# Altium schematic sheet Power.Schdoc
size B; Organization: VITRONIC Dr.-Ing. Stein Bildverarbeitungssysteme GmbH; Address1: Hasengartenstrasse 14; Address2: D-65189 Wiesbaden; Address3: Phone: 49/611/7152-0; Address4: Fax:     49/611/7152-133; SheetNumber: 3; SheetTotal: 3
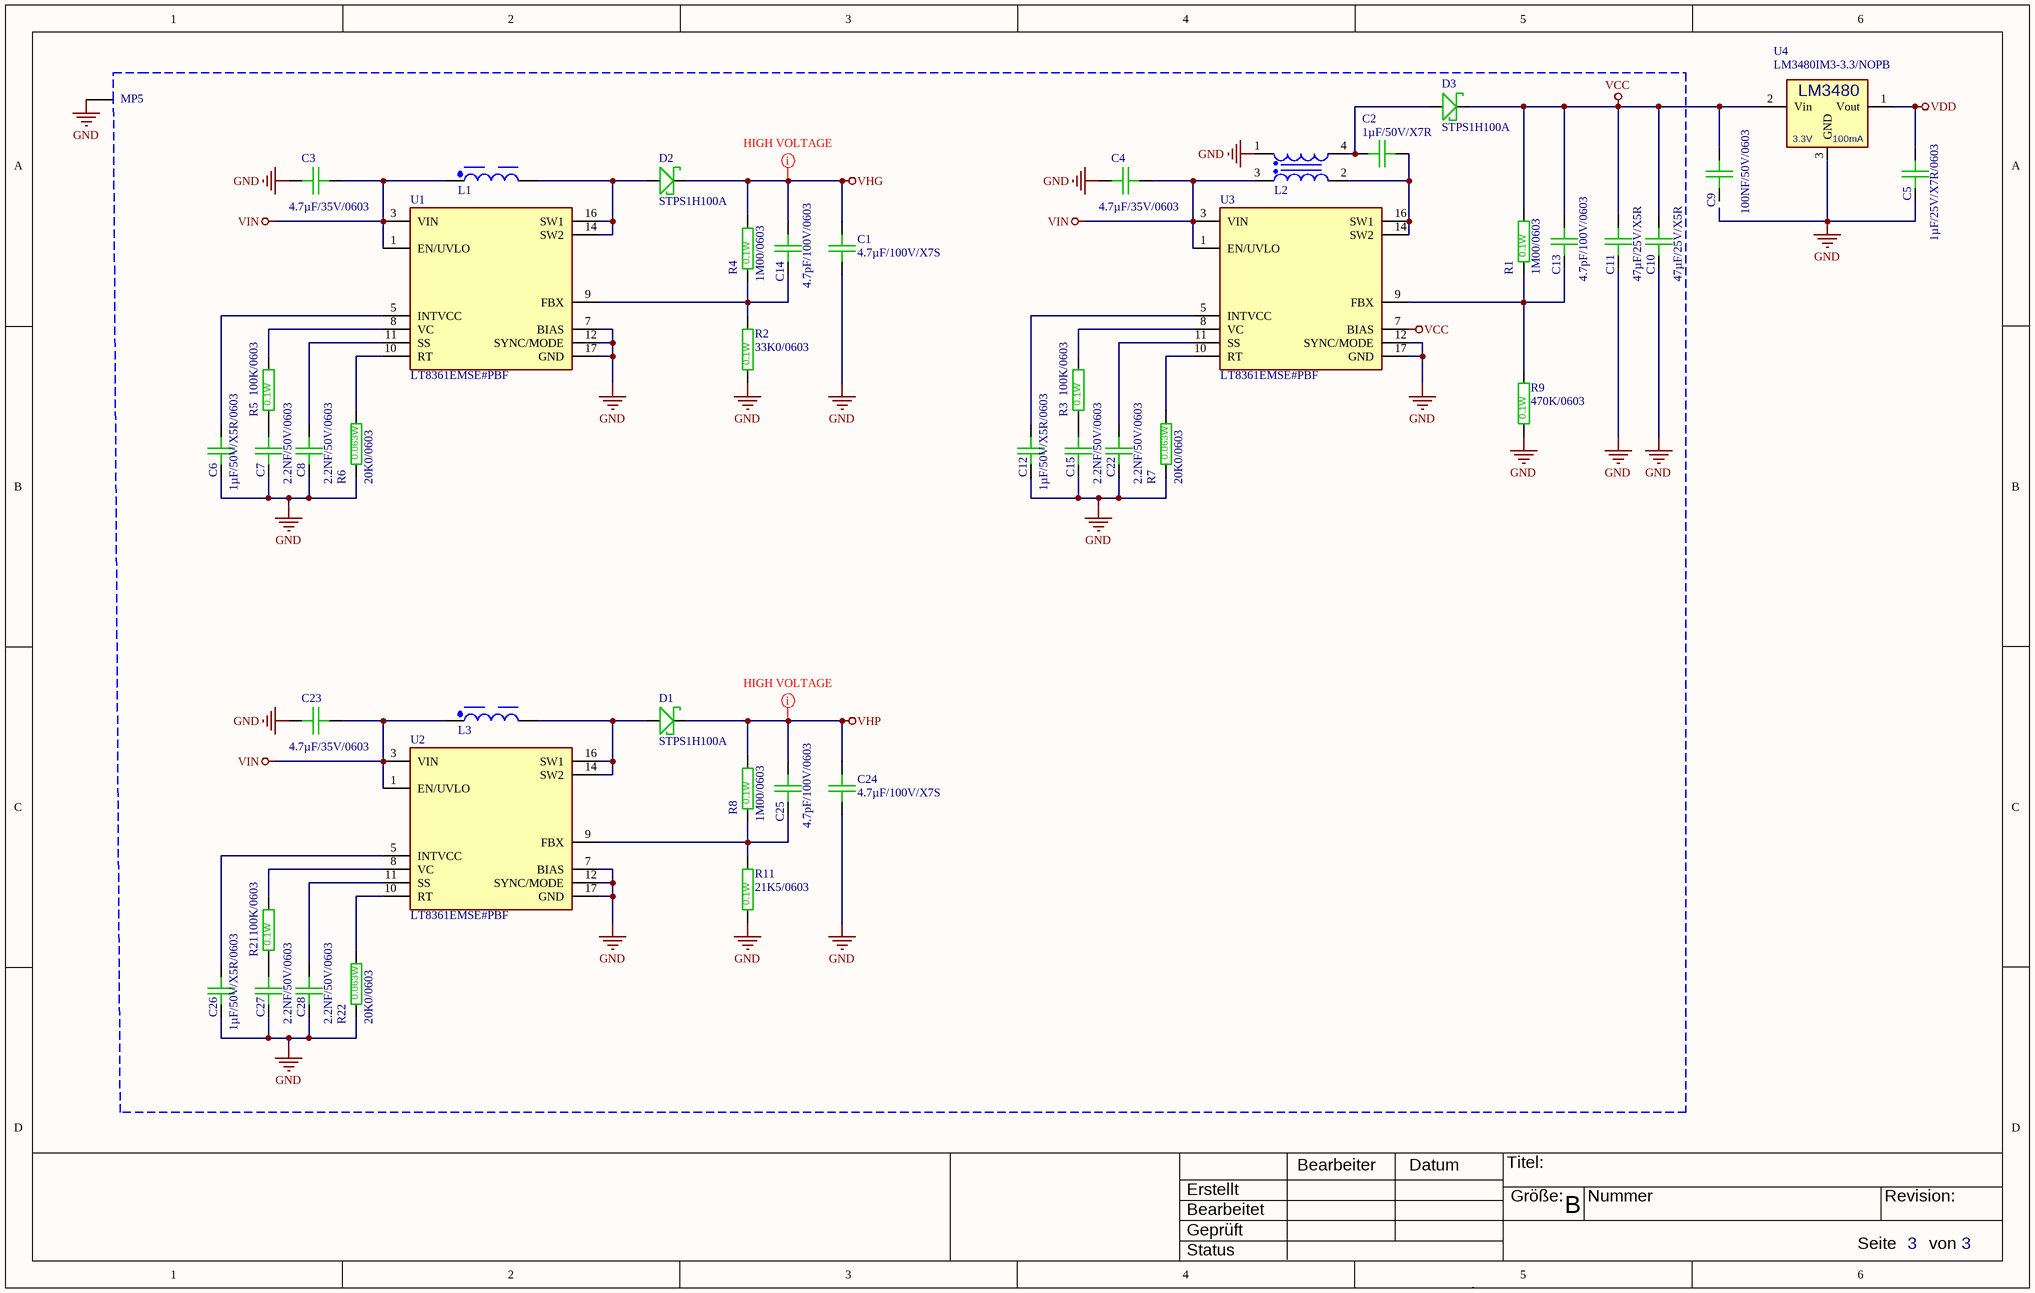
[diagram p0: Power.Schdoc]

## Parts
C1  4.7µF/100V/X7S  [1206__R]
C2  1µF/50V/X7R  [1206__R]
C3  4.7µF/35V/0603  [0603__R]
C4  4.7µF/35V/0603  [0603__R]
C5  1µF/25V/X7R/0603  [0603__R]
C6  1µF/50V/X5R/0603  [0603__R]
C7  2.2NF/50V/0603  [0603__R]
C8  2.2NF/50V/0603  [0603__R]
C9  100NF/50V/0603  [0603__R]
C10  47µF/25V/X5R  [1206__R]
C11  47µF/25V/X5R  [1206__R]
C12  1µF/50V/X5R/0603  [0603__R]
C13  4.7pF/100V/0603  [0603__R]
C14  4.7pF/100V/0603  [0603__R]
C15  2.2NF/50V/0603  [0603__R]
C22  2.2NF/50V/0603  [0603__R]
C23  4.7µF/35V/0603  [0603__R]
C24  4.7µF/100V/X7S  [1206__R]
C25  4.7pF/100V/0603  [0603__R]
C26  1µF/50V/X5R/0603  [0603__R]
C27  2.2NF/50V/0603  [0603__R]
C28  2.2NF/50V/0603  [0603__R]
D1  STPS1H100A  [SMA__R]
D2  STPS1H100A  [SMA__R]
D3  STPS1H100A  [SMA__R]
L1  6.8µH, 2.4A  [WE-TPC_8020]  (value not drawn)
L2  6.8µH, 1.45A  [WE-TDC_8038]  (value not drawn)
L3  6.8µH, 2.4A  [WE-TPC_8020]  (value not drawn)
MP5  3670570  [3670570]  (value not drawn)
R1  1M00/0603  [0603__R]
R2  33K0/0603  [0603__R]
R3  100K/0603  [0603__R]
R4  1M00/0603  [0603__R]
R5  100K/0603  [0603__R]
R6  20K0/0603  [0603__R]
R7  20K0/0603  [0603__R]
R8  1M00/0603  [0603__R]
R9  470K/0603  [0603__R]
R11  21K5/0603  [0603__R]
R21  100K/0603  [0603__R]
R22  20K0/0603  [0603__R]
U1  LT8361EMSE#PBF  [MSOP-16/12__R]
U2  LT8361EMSE#PBF  [MSOP-16/12__R]
U3  LT8361EMSE#PBF  [MSOP-16/12__R]
U4  LM3480IM3-3.3/NOPB  [SOT-23-3_PW__R]

## Nets
GND: C1.1 C3.2 C4.2 C5.1 C6.1 C7.1 C8.1 C10.1 C11.1 C12.1 C15.1 C22.1 C23.2 C24.1 C26.1 C27.1 C28.1 L2.1 MP5.1 R2.1 R6.1 R7.1 R9.1 R11.1 R22.1 U1.7(BIAS) U1.12(SYNC/MODE) U1.17(GND) U2.7(BIAS) U2.12(SYNC/MODE) U2.17(GND) U3.12(SYNC/MODE) U3.17(GND) U4.3(GND)
VCC: C9.2 C10.2 C11.2 C13.2 D3.2 R1.2 U3.7(BIAS) U4.2(Vin)
VDD: C5.2 U4.1(Vout)
VHG: C1.2 C14.2 D2.2 R4.2
VHP: C24.2 C25.2 D1.2 R8.2
VIN: C3.1 C4.1 C23.1 L1.1 L2.3 L3.1 U1.1(EN/UVLO) U1.3(VIN) U2.1(EN/UVLO) U2.3(VIN) U3.1(EN/UVLO) U3.3(VIN)
NetC2_1: C2.1 L2.2 U3.14(SW2) U3.16(SW1)
NetC2_2: C2.2 D3.1 L2.4
NetC6_2: C6.2 U1.5(INTVCC)
NetC7_2: C7.2 R5.1
NetC8_2: C8.2 U1.11(SS)
NetC12_2: C12.2 U3.5(INTVCC)
NetC13_1: C13.1 R1.1 R9.2 U3.9(FBX)
NetC14_1: C14.1 R2.2 R4.1 U1.9(FBX)
NetC15_2: C15.2 R3.1
NetC22_2: C22.2 U3.11(SS)
NetC25_1: C25.1 R8.1 R11.2 U2.9(FBX)
NetC26_2: C26.2 U2.5(INTVCC)
NetC27_2: C27.2 R21.1
NetC28_2: C28.2 U2.11(SS)
NetD1_1: D1.1 L3.2 U2.14(SW2) U2.16(SW1)
NetD2_1: D2.1 L1.2 U1.14(SW2) U1.16(SW1)
NetR3_2: R3.2 U3.8(VC)
NetR5_2: R5.2 U1.8(VC)
NetR6_2: R6.2 U1.10(RT)
NetR7_2: R7.2 U3.10(RT)
NetR21_2: R21.2 U2.8(VC)
NetR22_2: R22.2 U2.10(RT)

Not connected (* = marked no-connect by the designer): C9 1; U1 6(NC); U2 6(NC); U3 6(NC)

## Layout directives
net class HV: VHG, VHP

## Notes on the sheet
- Bearbeiter
- Datum
- Titel:
- Erstellt
- Bearbeitet
- Geprüft
- Größe:
- B
- Nummer
- Revision:
- Status
- Seite
- von
- (in symbol LM3480IM3-3.3/NOPB) LM3480; 3.3V        100mA

## Library data of the parts
C1 C24 = 4.7µF/100V/X7S: Capacitor, 4.7µF/100V, 10%, Ceramic X7S, SMD, 1206; Manufacturer: Murata; Manufacturer Part Number: GRM31CC72A475KE11L; Text Field1: 160347; Text Field7: Murata: GRM31CC72A475KE11L; Supplier 1: Digi-Key; Supplier Part Number 1: 490-18620-2-ND; Stock: 0; Pricing 1: 2000=0.29325 (USD); RoHS Compliant: Yes; ComponentLink1URL: https://search.murata.co.jp/Ceramy/image/img/A01X/G101/ENG/GRM31CC72A475KE11-01A.pdf?src-supplier=Digi-Key; ComponentLink1Description: https://search.murata.co.jp/Ceramy/image/img/A01X/G101/ENG/GRM31CC72A475KE11-01A.pdf?src-supplier=Digi-Key
C2 = 1µF/50V: Capacitor, 1µF/50V, 10%, Ceramic X7R, SMD, 1206; Text Field1: 80129; Text Field3: 1206; Text Field4: 1µF; Text Field5: 50V; Text Field7: 1206, 50V, ±10%, X7R; Text Field8: 10; Text Field2: SMD; Text Field6: 10%
C3 C4 C23 = 4.7µF/35V/0603: Capacitor, 4.7µF, 35V, 10%, Ceramic X5R, SMD, 0603, Low ESR; Manufacturer: TDK; Manufacturer Part Number: C1608X5R1V475K080AC; Text Field1: 160313; Text Field7: TDK: C1608X5R1V475K080AC; Capacitance: 4.7uF; Supplier 1: Digi-Key; Supplier Part Number 1: 445-9064-1-ND; Stock: 37688; Mount: Surface Mount; Case/Package: 0603; Case Code (Metric): 1608; Case Code (Imperial): 0603; Weight: 7.1E-05oz; Dielectric Material: Ceramic; Min Operating Temperature: -55°C; Max Operating Temperature: 85°C; Voltage Rating: 35V; Tolerance: 10%; Packaging: Tape and Reel; Termination: SMD/SMT; Series: C; Package Quantity: 1; Voltage Rating (DC): 35V; Dielectric: X5R; Resistor Type: Ceramic; Length: 0.063inch; Width: 0.031inch; Height: 0.8mm; Thickness: 0.039inch; Depth: 0.8mm; REACH SVHC: No SVHC; Lead Free: Lead Free; RoHS Compliant: Yes; ComponentLink1URL: http://www.mouser.com/ds/2/400/lcc_commercial_general_en-837201.pdf?src-supplier=Mouser; ComponentLink1Description: http://www.mouser.com/ds/2/400/lcc_commercial_general_en-837201.pdf?src-supplier=Mouser
C5 = 1µF/25V/X7R/0603: Capacitor, 1µF, 25V, X7R, 10%, Ceramic, SMD, 0603; Manufacturer: Taiyo Yuden; Manufacturer Part Number: TMK107B7105KA-T; Text Field1: 138672; Text Field7: 0603, 25V, ±10%, X7R; Catalog Drawings: xMK Series_0603_0.8; Online Catalog: M Series; Other Names: 587-2984-6; Supplier 1: Digikey; Supplier Part Number 1: 587-2984-2-ND; Stock: 1604000; Pricing 1: 4000=0.0121, 8000=0.011, 12000=0.0105, 28000=0.01, 100000=0.0073 (USD); Standard Package: 1; Category: Capacitors; Family: Ceramic Capacitors; Series: M; Packaging: Digi-Reel®; Capacitance: 1µF; Tolerance: ±10%; Voltage - Rated: 25V; Temperature Coefficient: X7R; Mounting Type: Surface Mount, MLCC; Operating Temperature: -55°C ~ 125°C; Applications: General Purpose; Ratings: -; Package / Case: 0603 (1608 Metric); Size / Dimension: 0.063" L x 0.031" W (1.60mm x 0.80mm); Height - Seated (Max): -; Thickness (Max): 0.035" (0.90mm); Lead Spacing: -; Features: -; Lead Style: -; ComponentLink1URL: https://datasheet.ciiva.com/15922/374tmk107b7105ka-t-15922376.pdf; ComponentLink1Description: https://datasheet.ciiva.com/15922/374tmk107b7105ka-t-15922376.pdf; ComponentLink2URL: https://datasheet.ciiva.com/30163/854tmk107b7105ka-t-30163691.pdf; ComponentLink2Description: https://datasheet.ciiva.com/30163/854tmk107b7105ka-t-30163691.pdf; ComponentLink3URL: https://datasheet.ciiva.com/2990/tmk107b7105ka-t-ss-2990064.pdf; ComponentLink3Description: https://datasheet.ciiva.com/2990/tmk107b7105ka-t-ss-2990064.pdf; ComponentLink4URL: https://datasheet.ciiva.com/133/tmk107b7105ka-t-ss-133732.pdf; ComponentLink4Description: https://datasheet.ciiva.com/133/tmk107b7105ka-t-ss-133732.pdf
C6 C12 C26 = 1µF/50V/X5R/0603: Capacitor, 1µF, 50V, X5R, 10%, Ceramic, SMD, 0603; Text Field1: 163284; Text Field3: 0603; Text Field7: 0603, 50V, ±10%, X5R; Text Field8: 4; Text Field2: SMD; Text Field4: 1µF; Text Field5: 50V; Text Field6: X5R
C7 C8 C15 C22 C27 C28 = 2.2NF/50V/0603: Capacitor, 2.2nF, 50V, 10%, Ceramic, SMD, 0603; Manufacturer: KEMET; Manufacturer Part Number: C0603C222K5RAC   TU; Text Field1: 102033; Text Field7: 0603, 50V, ±10%, X5R; Supplier 1: Farnell; RoHS: YES; Stock 1: 3711; Pricing 1: 1=0,009, 10=0,009, 100=0,008, 500=0,006, 1000=0,005, 2500=0,005 (EUR); ComponentLink1URL: http://www.kemet.com/kemet/web/homepage/kechome.nsf/vapubfiles/KEM_C1002_X7R_SMD.pdf/$file/KEM_C1002_X7R_SMD.pdf; ComponentLink1Description: http://www.kemet.com/kemet/web/homepage/kechome.nsf/vapubfiles/KEM_C1002_X7R_SMD.pdf/$file/KEM_C1002_X7R_SMD.pdf; ComponentLink2URL: http://www.farnell.com/cad/1455899.zip; ComponentLink2Description: http://www.farnell.com/cad/1455899.zip; Supplier Part Number 1: 1167798
C9 = 100NF/50V/0603: Capacitor, 100nF, 50V, 10%, Ceramic XR7, SMD, 0603; Manufacturer: KEMET; Manufacturer Part Number: C0603X104K5RACTU; Text Field1: 113024; Text Field7: 0603, 50V, ±10%, X7R; Kapazitätswert: 0.1; Dielektrische Charakteristik: X7R; Nennspannung: 50; Kondensatorgehäusestil: 0603 [1608 Metric]; Betriebstemperaturbereich: -55°C bis +125; SVHC: No SVHC (18-Jun-2012); Anschlusstyp: Surface Mount (SMD, SMT); Breite/Weite: 0.8; Gehäusetyp: 0603; Länge/Höhe, Außen-: 1.6; Min Betriebstemperatur: -55; Pin, Anzahl der: 2; Serie: FT; Temperatur, Betriebs- max.: 125; Supplier 1: Farnell; RoHS: YES; Stock 1: 97613; Pricing 1: 10=0,084, 100=0,042, 500=0,029, 1000=0,021, 4000=0,016 (EUR); Kapazitätstoleranz: ± 10%; Capacitor Terminals: SMD; Tiefe, Außen: 0.8; Toleranz +: 10%; Toleranz -: 10%; VDC Nennspannung: 50; ComponentLink1URL: http://www.farnell.com/datasheets/75233.pdf; ComponentLink1Description: http://www.farnell.com/datasheets/75233.pdf; ComponentLink2URL: http://www.farnell.com/cad/1558668.zip; ComponentLink2Description: http://www.farnell.com/cad/1558668.zip; Supplier Part Number 1: 1414028
C10 C11 = 47µF/25V/X5R: Capacitor, 47µF/25V, 20%, Ceramic X5R, SMD, 1206; Manufacturer: TDK; Manufacturer Part Number: C3216X5R1E476M160AC; Text Field1: 153145; Text Field7: TDK: C3216X5R1E476M160AC; Capacitance: 47uF; Voltage Rating: 25V; Supplier 1: Digi-Key; Supplier Part Number 1: 445-8047-2-ND; Stock: 216000; Pricing 1: 2000=0.385, 4000=0.37125, 10000=0.3575, 14000=0.35063 (USD); Mount: Surface Mount; Case/Package: 1206; Weight: 0.000571oz; Case Code (Metric): 3216; Case Code (Imperial): 1206; Dielectric Material: Ceramic; Min Operating Temperature: -55°C; Max Operating Temperature: 85°C; Tolerance: 20%; Packaging: Tape and Reel; Voltage Rating (DC): 25V; Termination: SMD/SMT; Package Quantity: 1; Dielectric: X5R; Composition: Ceramic; Voltage: 25V; Length: 3.2mm; Height: 1.6mm; Width: 0.063inch; Depth: 1.6mm; Thickness: 1.6mm; Lead Free: Lead Free; REACH SVHC: No SVHC; ComponentLink1URL: https://product.tdk.com/info/en/documents/chara_sheet/C3216X5R1E476M160AC.pdf?src-supplier=Digi-Key; ComponentLink1Description: https://product.tdk.com/info/en/documents/chara_sheet/C3216X5R1E476M160AC.pdf?src-supplier=Digi-Key; ComponentLink2URL: https://product.tdk.com/info/en/catalog/datasheets/mlcc_commercial_general_en.pdf?src-supplier=Digi-Key; ComponentLink2Description: https://product.tdk.com/info/en/catalog/datasheets/mlcc_commercial_general_en.pdf?src-supplier=Digi-Key; ComponentLink3URL: http://www.tdk.com/pdf/general_B11.pdf?src-supplier=Future+Electronics; ComponentLink3Description: http://www.tdk.com/pdf/general_B11.pdf?src-supplier=Future+Electronics
C13 C14 C25 = 4.7NF/50V/0603: Capacitor, 4.7pF, 100V, 10%, Ceramic, SMD, 0603; Text Field1: 87196; Text Field3: 0603; Text Field4: 4.7nF; Text Field5: 50V; Text Field7: 0603,50V, ±10%, X7R; Text Field8: 4; Text Field2: SMD; Text Field6: 10%
D1-D3 = STPS1H100A: DIODE SCHOTTKY 100V 1A SMA; Manufacturer: STMicroelectronics; Voltage - Forward (Vf) (Max) @ If: 770mV @ 1A; Speed: Fast Recovery =< 500ns, > 200mA (Io); Current - Reverse Leakage @ Vr: 4µA @ 100V; Text Field1: 111565; Text Field7: STMicroelectronics: STPS1H100A; Supplier 1: Digi-Key; RoHS: RoHS Compliant; Category: Discrete Semiconductor Products; Stock 1: 111470; Pricing 1: 1=0.41, 10=0.345, 25=0.3024, 100=0.259, 250=0.2246, 500=0.19026, 1000=0.14667, 2500=0.1341 (EUR); Diode Type: Schottky; Voltage - DC Reverse (Vr) (Max): 100V; Current - Average Rectified (Io): 1A; Reverse Recovery Time (trr): -; Capacitance @ Vr, F: -; Mounting Type: Surface Mount; Package / Case: DO-214AC, SMA; Supplier Device Package: SMA; Packaging: Digi-Reel®; ComponentLink1URL: http://www.st.com/internet/com/TECHNICAL_RESOURCES/TECHNICAL_LITERATURE/DATASHEET/CD00001304.pdf; ComponentLink1Description: http://www.st.com/internet/com/TECHNICAL_RESOURCES/TECHNICAL_LITERATURE/DATASHEET/CD00001304.pdf; Supplier Part Number 1: 497-3209-6-ND; Manufacturer Part Number: STPS1H100A
L1 L3 = 7440700068: WE-TPC SMT Tiny Power Inductor, size 8020, 6.8µH, 2.4A, 68mΩ; Manufacturer: Wurth Elektronik; Case/Size Code: 8020; DC Resistance: 56mΩ; Saturation Current: 1.8A; Self Resonant Frequency: 55MHz; Manufacturer Part Number: 7440700068; Category: Shielded Power Inductors; Match Code: WE-TPC; ComponentLink1Description: Website Link; ComponentLink1URL: https://www.we-online.com/redexpert/article/7440700068?ad; ComponentLink2Description: Datasheet Link; ComponentLink2URL: https://www.we-online.com/redexpert/spec/7440700068?ad; Mount: Surface Mount; Operating Temperature Max: 125°C; Operating Temperature Min: -40°C; Packaging: Tape and Reel; Length: 8mm; Width: 8mm; Height: 1.8mm; DC Resistance Max: 68mΩ; Inductance: 6.8µH; Rated Current: 2.4A
L2 = 74489440068: WE-TDC SMT Shielded Coupled Inductor, size 8038, 6.8µH, 1.45A, 100mΩ; Manufacturer: Wurth Elektronik; Case/Size Code: 8038; DC Resistance 1: 88mΩ; Rated Voltage: 80V; Saturation Current: 3.2A; Self Resonant Frequency: 25MHz; Manufacturer Part Number: 74489440068; Category: Coupled Power Inductors; Match Code: WE-TDC; ComponentLink1Description: Website Link; ComponentLink1URL: https://www.we-online.com/redexpert/article/74489440068?ad; ComponentLink2Description: Datasheet Link; ComponentLink2URL: https://www.we-online.com/redexpert/spec/74489440068?ad; Mount: Surface Mount; Operating Temperature Max: 125°C; Operating Temperature Min: -40°C; Packaging: Tape and Reel; Length: 8mm; Width: 8mm; Height: 3.8mm; DC Resistance 2: 88mΩ; DC Resistance Max 1: 100mΩ; DC Resistance Max 2: 100mΩ; Inductance 1: 6.8µH; Inductance 2: 6.8µH; Rated Current 1: 1.45A; Rated Current 2: 1.45A
MP5 = 3670570: WE-SHC Shielding Cabinet, SMT Frame Seamless, Tin Plated, Tray, 57x31x6mm; Manufacturer: Wurth Elektronik; Base Material: Steel; ComponentLink1Description: Website Link; ComponentLink1URL: https://www.we-online.com/redexpert/article/3670570?ad; ComponentLink2Description: Datasheet Link; ComponentLink2URL: https://www.we-online.com/redexpert/spec/3670570?ad; Manufacturer Part Number: 3670570; Category: EMC Shielding; Match Code: WE-SHC; Mount: Surface Mount; Operating Temperature Max: 125°C; Operating Temperature Min: -40°C; Packaging: Tray; Length: 57mm; Width: 31mm; Height: 6mm; Plating: Tin Plated; Type: SMT Frame Seamless
R1 R4 R8 = 1M00/0603: Resistor, 1M00, 0,1 W, 1,0 %, TK50, Metallschicht, SMD, 0603; Text Field1: 69900; Text Field3: 0603; Text Field5: 0.1W; Text Field6: 1%, TK100; Text Field7: 0603, 0,1 W, 1,0 %, TK50; Text Field8: 4; Text Field2: SMD; Text Field4: 1M00
R2 = 33K0/0603: Resistor, 33K, 0,1 W, 1,0 %, TK50, Metallschicht, SMD, 0603; Text Field1: 86418; Text Field3: 0603; Text Field5: 0.1W; Text Field6: TK100; Text Field7: 0603, 0,1 W, 1,0 %, TK50; Text Field8: 4; Text Field2: SMD; Text Field4: 33K
R3 R5 R21 = 100K/0603: Resistor, 100K, 0.1W, 1%, TK50, Metallschicht, SMD, 0603; Text Field1: 70755; Text Field3: 0603; Text Field7: 0603, 0,1 W, 1,0 %, TK50; Text Field8: 4; Text Field2: SMD; Text Field4: 100K; Text Field5: 0.1W; Text Field6: 1%, TK50
R6 R7 R22 = 20K0/0603: Resistor, 20K0, 0.063W, 1%, TK100, Metallschicht, SMD, 0603; Text Field1: 82523; Text Field3: 0603; Text Field7: 0603, 0,1 W, 1,0 %, TK100; Text Field8: 4; Text Field2: SMD; Text Field4: 20K0; Text Field5: 0.063W; Text Field6: 1%, TK100
R9 = 470K/0603: Resistor, 470K, 0.1W, 1%, TK50, Metallschicht, SMD, 0603; Text Field1: 114671; Text Field3: 0603; Text Field7: 0603, 0,1 W, 1,0 %, TK50; Text Field8: 4; Text Field2: SMD; Text Field4: 470K; Text Field5: 0.1W; Text Field6: 1%, TK50
R11 = 22K0/0603: Resistor, 21K5, 0.1W, 1%, TK50, Metallschicht, SMD, 0603; Text Field1: 73115; Text Field3: 0603; Text Field4: 22K0; Text Field7: 0603, 0,1 W, 1,0 %, TK50; Text Field8: 4; Text Field2: SMD; Text Field5: 0.1W; Text Field6: 1%, TK50
U1-U3 = LT8361EMSE#PBF: Conv DC-DC 2.8V to 60V Step Up Single-Out 100V 2A Automotive 12-Pin MSOP EP Tube; Manufacturer_Name: Analog Devices; Geometry.Height: 1.1mm; Mouser Part Number: 584-LT8361EMSE#PBF; Mouser Price/Stock: https://www.mouser.co.uk/ProductDetail/Analog-Devices/LT8361EMSEPBF?qs=y6ZabgHbY%252ByVuSTCW6h07w%3D%3D; Manufacturer_Part_Number: LT8361EMSE#PBF; Datasheet Link: https://www.mouser.fi/datasheet/2/609/lt8361-1568840.pdf
U4 = LM3480IM3-3.3/NOPB: LDO, SOT-23, 3V3 OUT 100mA, Vinmax 30V, SMD; Manufacturer: Texas Instruments; Text Field1: 131797; Text Field7: TI: LM3480IM3-3.3/NOPB; Regulator Topology: Positive Fixed; Voltage - Output: 3.3V; Voltage - Dropout (Typical): 0.9V @ 100mA; Number of Regulators: 1; Voltage - Input: Up to 30V; Supplier 1: Digi-Key; Supplier Part Number 1: LM3480IM3-3.3/NOPBTR-ND; Manufacturer Part Number: LM3480IM3-3.3/NOPB; RoHS: RoHS Compliant; Category: Integrated Circuits (ICs); Stock 1: 23000; Pricing 1: 1000=0.3183 (EUR); Packaging: Tape & Reel (TR); Part Status: Active; Current - Output: 100mA; Current - Limit (Min): -; Operating Temperature: -40°C ~ 125°C; Mounting Type: Surface Mount; Package / Case: TO-236-3, SC-59, SOT-23-3; Supplier Device Package: SOT-23-3; ComponentLink1URL: http://www.ti.com/lit/ds/symlink/lm3480.pdf; ComponentLink1Description: http://www.ti.com/lit/ds/symlink/lm3480.pdf